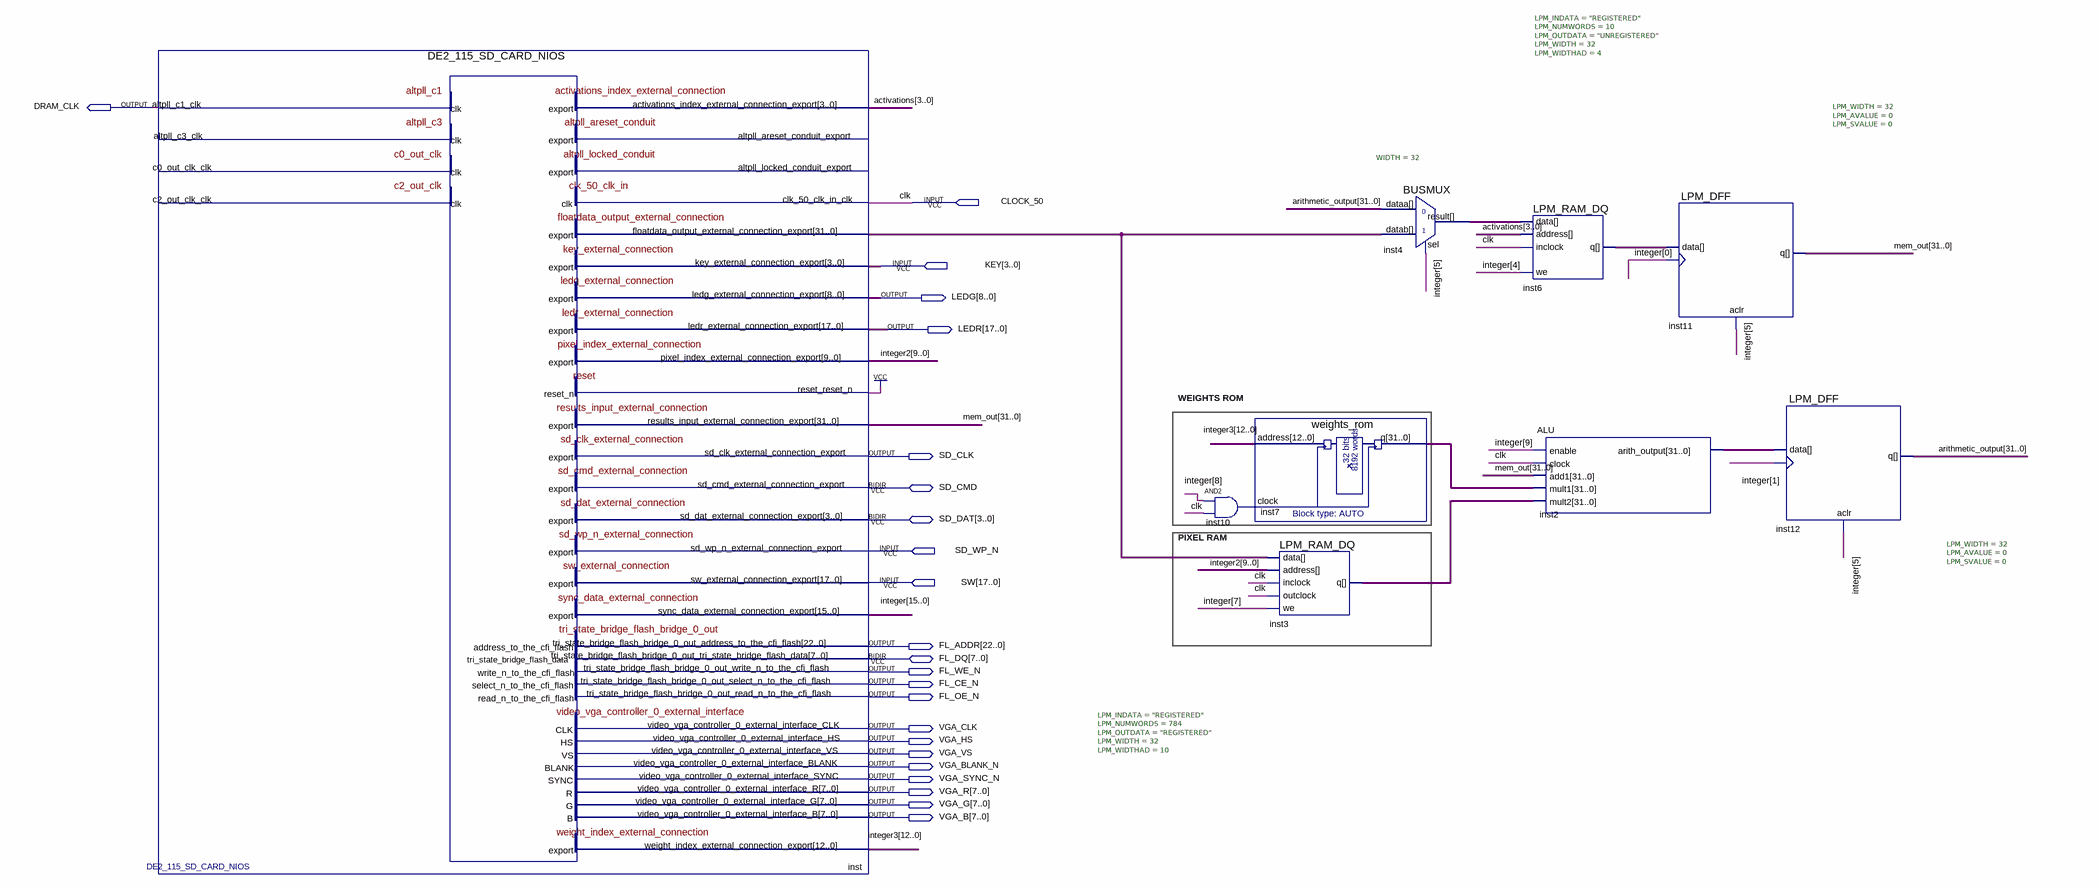
[diagram p0: schematic sheet]
// Quartus schematic new_toplevel.bdf as structural Verilog: 9 symbols, 23 pins
module new_toplevel (
  input  CLOCK_50,
  input  [3:0] KEY,
  input  SD_WP_N,
  input  [17:0] SW,
  inout  SD_CMD,
  inout  [3:0] SD_DAT,
  inout  [7:0] FL_DQ,
  output DRAM_CLK,
  output [8:0] LEDG,
  output [17:0] LEDR,
  output SD_CLK,
  output [22:0] FL_ADDR,
  output FL_WE_N,
  output FL_CE_N,
  output FL_OE_N,
  output VGA_CLK,
  output VGA_HS,
  output VGA_VS,
  output VGA_BLANK_N,
  output VGA_SYNC_N,
  output [7:0] VGA_R,
  output [7:0] VGA_G,
  output [7:0] VGA_B
);

  wire inst10_out;
  wire [3:0] activations;
  wire [9:0] integer2;
  wire [12:0] integer3;
  wire [15:0] \integer ;
  wire [31:0] arithmetic_output, inst2_arith_output, inst3_q, inst4_result, inst6_q, inst7_q,
       inst_floatdata_output_external_connection_export, mem_out;

  DE2_115_SD_CARD_NIOS inst (
    .clk_50_clk_in_clk(CLOCK_50), .key_external_connection_export(KEY), .reset_reset_n(1'b1),
    .results_input_external_connection_export(mem_out), .sd_wp_n_external_connection_export(SD_WP_N),
    .sw_external_connection_export(SW), .activations_index_external_connection_export(activations),
    .altpll_c1_clk(DRAM_CLK),
    .floatdata_output_external_connection_export(inst_floatdata_output_external_connection_export),
    .ledg_external_connection_export(LEDG), .ledr_external_connection_export(LEDR),
    .pixel_index_external_connection_export(integer2), .sd_clk_external_connection_export(SD_CLK),
    .sync_data_external_connection_export(\integer ),
    .tri_state_bridge_flash_bridge_0_out_address_to_the_cfi_flash(FL_ADDR),
    .tri_state_bridge_flash_bridge_0_out_write_n_to_the_cfi_flash(FL_WE_N),
    .tri_state_bridge_flash_bridge_0_out_select_n_to_the_cfi_flash(FL_CE_N),
    .tri_state_bridge_flash_bridge_0_out_read_n_to_the_cfi_flash(FL_OE_N),
    .video_vga_controller_0_external_interface_CLK(VGA_CLK),
    .video_vga_controller_0_external_interface_HS(VGA_HS),
    .video_vga_controller_0_external_interface_VS(VGA_VS),
    .video_vga_controller_0_external_interface_BLANK(VGA_BLANK_N),
    .video_vga_controller_0_external_interface_SYNC(VGA_SYNC_N),
    .video_vga_controller_0_external_interface_R(VGA_R), .video_vga_controller_0_external_interface_G(VGA_G),
    .video_vga_controller_0_external_interface_B(VGA_B), .weight_index_external_connection_export(integer3),
    .sd_cmd_external_connection_export(SD_CMD), .sd_dat_external_connection_export(SD_DAT),
    .tri_state_bridge_flash_bridge_0_out_tri_state_bridge_flash_data(FL_DQ));  // open: altpll_areset_conduit_export, altpll_c3_clk, altpll_locked_conduit_export, c0_out_clk_clk, c2_out_clk_clk
  and inst10 (inst10_out, \integer [8], CLOCK_50);
  weights_rom inst7 (.address(integer3), .clock(inst10_out), .q(inst7_q));
  LPM_RAM_DQ #(.LPM_INDATA("REGISTERED"), .LPM_NUMWORDS(784), .LPM_OUTDATA("REGISTERED"), .LPM_WIDTH(32), .LPM_WIDTHAD(10)) inst3 (
    .inclock(CLOCK_50), .data(inst_floatdata_output_external_connection_export), .address(integer2),
    .we(\integer [7]), .outclock(CLOCK_50), .q(inst3_q));
  BUSMUX #(.WIDTH(32)) inst4 (
    .datab(inst_floatdata_output_external_connection_export), .sel(\integer [5]), .dataa(arithmetic_output),
    .result(inst4_result));
  LPM_RAM_DQ #(.LPM_INDATA("REGISTERED"), .LPM_NUMWORDS(10), .LPM_OUTDATA("UNREGISTERED"), .LPM_WIDTH(32), .LPM_WIDTHAD(4)) inst6 (
    .address(activations), .data(inst4_result), .inclock(CLOCK_50), .we(\integer [4]), .q(inst6_q));
  ALU inst2 (
    .enable(\integer [9]), .clock(CLOCK_50), .add1(mem_out), .mult1(inst7_q), .mult2(inst3_q),
    .arith_output(inst2_arith_output));
  LPM_DFF #(.LPM_WIDTH(32), .LPM_AVALUE(0), .LPM_SVALUE(0)) inst11 (
    .clock(\integer [0]), .data(inst6_q), .aclr(\integer [5]), .q(mem_out));
  LPM_DFF #(.LPM_WIDTH(32), .LPM_AVALUE(0), .LPM_SVALUE(0)) inst12 (
    .clock(\integer [1]), .data(inst2_arith_output), .aclr(\integer [5]), .q(arithmetic_output));

  // Other names for the same wires on the sheet: clk = CLOCK_50

  // Notes on the sheet:
  //   WEIGHTS ROM
  //   PIXEL RAM
endmodule
